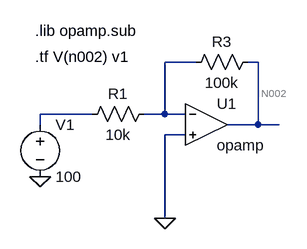
[diagram p0: schematic pag7es7p1.asc]
pag7es7p1.asc, the LTspice schematic file:
Version 4
SHEET 1 880 680
WIRE 224 48 176 48
WIRE 320 48 304 48
WIRE 64 128 -16 128
WIRE 176 128 176 48
WIRE 176 128 144 128
WIRE 208 128 176 128
WIRE -16 144 -16 128
WIRE 320 144 320 48
WIRE 320 144 272 144
WIRE 352 144 320 144
WIRE 208 160 176 160
WIRE 176 288 176 160
FLAG -16 224 0
FLAG 176 288 0
SYMBOL res 160 112 R90
WINDOW 0 0 56 VBottom 2
WINDOW 3 32 56 VTop 2
SYMATTR InstName R1
SYMATTR Value 10k
SYMBOL voltage -16 128 R0
SYMATTR InstName V1
SYMATTR Value 100
SYMBOL OpAmps\\opamp 240 80 R0
SYMATTR InstName U1
SYMBOL res 320 32 R90
WINDOW 0 0 56 VBottom 2
WINDOW 3 32 56 VTop 2
SYMATTR InstName R3
SYMATTR Value 100k
TEXT -24 40 Left 2 !.tf V(n002) v1
TEXT -24 0 Left 2 !.lib opamp.sub

The netlist it stands for:
* pag7es7p1.asc
R1 N001 N003 10k
V1 N003 0 100
XU1 N001 0 N002 opamp Aol=100K GBW=10Meg  ; pins invin noninvin out
R3 N002 N001 100k
.tf V(n002) v1
.lib opamp.sub
.backanno
.end